# EAGLE design IT01 (EAGLE 6.3)
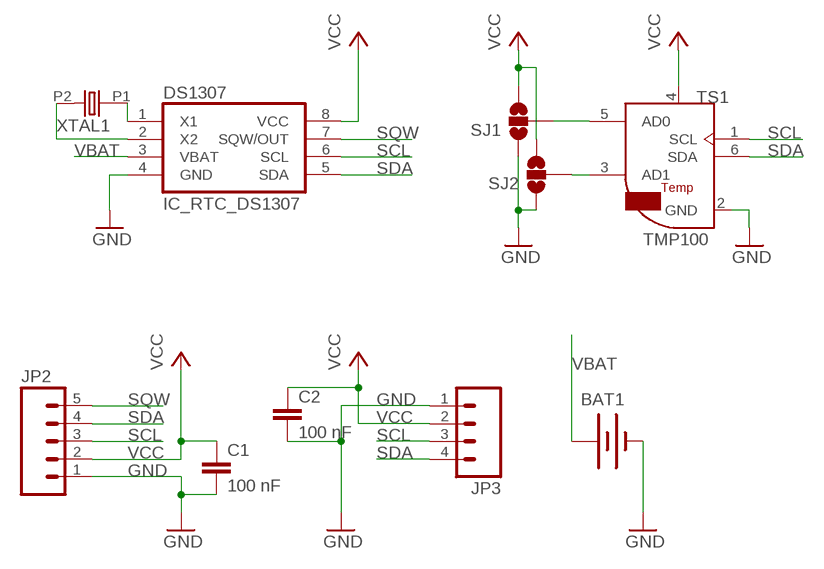
[diagram p0: schematic, sheet 1]

## Parts
BAT1  BATTERY12MM  [BATTCON_12MM]
C1  100 nF  C-EUC0805  [C0805]
C2  100 nF  C-EUC0805  [C0805]
DS1307  IC_RTC_DS1307  [SO-8]
JP2  M05PTH  [1X05]
JP3  M04PTH  [1X04]
SJ1  SOLDERJUMPER_2WAY-OLDT  [SJ_2]
SJ2  SOLDERJUMPER_2WAY-OLDT  [SJ_2]
TS1  TMP100  [SOT23-6]
XTAL1  OSC-XTAL-TC-38  [TC-38]

## Nets
AD0: SJ1.2 TS1.5(AD0)
AD1: SJ2.2 TS1.3(AD1)
GND: BAT1.GND(-) C1.2 C2.2 DS1307.4(GND) JP2.1 JP3.1 SJ1.1 SJ2.1 TS1.2(GND)
N$1: DS1307.1(X1) XTAL1.P1
N$2: DS1307.2(X2) XTAL1.P2
SCL: DS1307.6(SCL) JP2.3 JP3.3 TS1.1(SCL)
SDA: DS1307.5(SDA) JP2.4 JP3.4 TS1.6(SDA)
SQW: DS1307.7(SQW/OUT) JP2.5
VBAT: BAT1.PWR@1(+) DS1307.3(VBAT)
VCC: C1.1 C2.1 DS1307.8(VCC) JP2.2 JP3.2 SJ1.3 SJ2.3 TS1.4(UCC)

## Library data of the parts
BAT1 = SparkFun:BATTERY: Battery Holders Various common sizes : AA, AAA, 20mm coin cell and 12mm coin cell.
C1 C2 = resistor:C-EU: CAPACITOR, European symbol
DS1307 = dp_devices:IC_RTC_DS1307
JP2 = SparkFun:M05: Header 5 Standard 5-pin 0.1" header. Use with straight break away headers (SKU : PRT-00116), right angle break away headers (PRT-00553), swiss pins (PRT-00743), machine pins (PRT-00117), and female headers (PRT-00115). Molex polarized connector foot print use with SKU : PRT-08230 with associated crimp pins and housings.
JP3 = SparkFun:M04: Header 4 Standard 4-pin 0.1" header. Use with straight break away headers (SKU : PRT-00116), right angle break away headers (PRT-00553), swiss pins (PRT-00743), machine pins (PRT-00117), and female headers (PRT-00115). Molex polarized connector foot print use with SKU : PRT-08231 with associated crimp pins and housings. 1MM SMD Version SKU: PRT-10208
SJ1 SJ2 = SparkFun:SOLDERJUMPER_2WAY-OLD: Solder Jumper 2 way solder jumper
TS1 = termosensor:TMP100
XTAL1 = dp_devices:OSC-XTAL

## Board
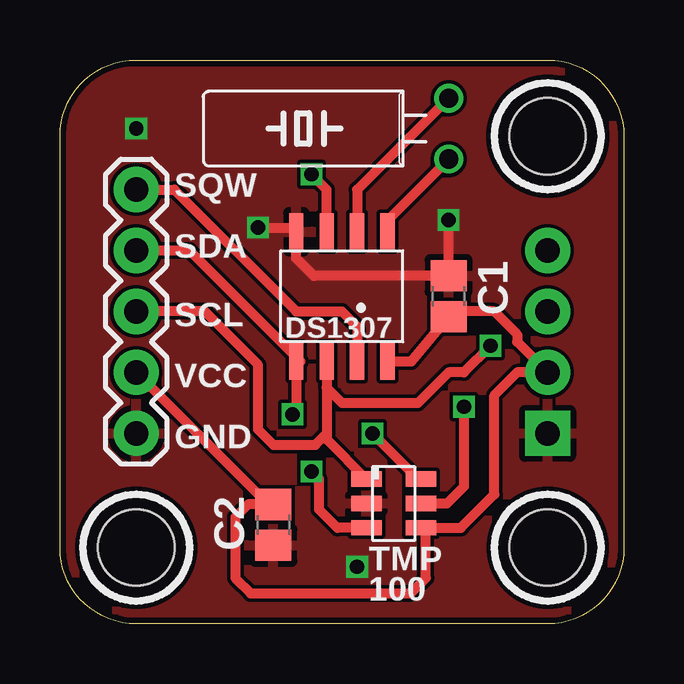
[diagram p1: board, top side]
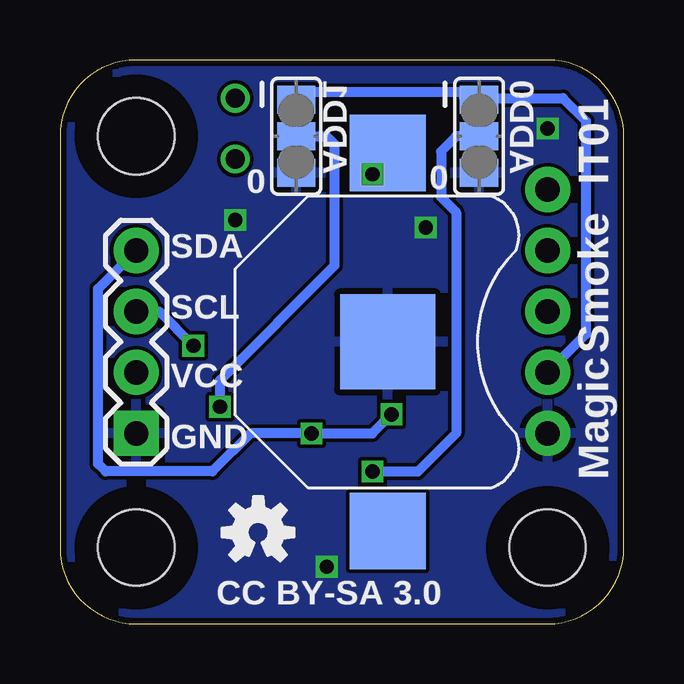
[diagram p2: board, bottom side, seen from below]

Size 23.5 x 23.5 mm. Coordinates in mm from the lower left corner, seen from the top.
Outline: 0,3.17 0,20.32 arc-90 3.17,23.5 20.32,23.5 arc-90 23.5,20.32 23.5,3.17 arc-90 20.32,0 3.17,0 arc-90 0,3.17
Copper layers (1*2*15*16): Top 0.035mm / dielectric 0.2mm / layer 2 0.0175mm / dielectric 1.1mm / layer 15 0.0175mm / dielectric 0.2mm / Bottom 0.035mm
Design rules "SeeedStudio_DRU_no_angle_20130527": minimum track width 6mil, minimum drill 12mil, track to track 6mil, track to pad 6mil, pad to pad 6mil, via to via 6mil, smd to smd 0mil, copper to edge 10mil, drill to drill 10mil, minimum pad ring 6mil, minimum via ring 6mil, stop-mask expansion 2mil, vias tented up to drill 25mil, thermal gap 10mil
Holes 3.17 mm at 3.17,3.17 20.32,3.17 20.32,20.32
tRestrict: area 17.8,17.8 to 22.9,22.9; area 0.6,0.6 to 5.7,5.7; area 17.8,0.6 to 22.9,5.7
bRestrict: area 17.8,17.8 to 22.9,22.9; area 0.6,0.6 to 5.7,5.7; area 17.8,0.6 to 22.9,5.7

### Footprints (pad centres in the part's own frame; a part is rotated, then mirrored left to right if it is on the bottom)
BATTCON_12MM = smd 3.962 x 3.962: GND 0,0 | smd 3.175 x 3.175: PWR@1 -7.874,0; PWR@2 7.874,0
C0805 = smd 1.3 x 1.5: 1 -0.85,0; 2 0.85,0
SO-8 = smd 0.6 x 1.55: 1 -1.905,-2.69; 2 -0.635,-2.69; 3 0.635,-2.69; 4 1.905,-2.69; 5 1.905,2.71; 6 0.635,2.71; 7 -0.635,2.71; 8 -1.905,2.71
1X05 = drill 1.016 pad 1.88: 1 0,0; 2 2.54,0; 3 5.08,0; 4 7.62,0; 5 10.16,0
1X04 = drill 1.016 pad 1.88 square: 1 0,0 | drill 1.016 pad 1.88: 2 2.54,0; 3 5.08,0; 4 7.62,0
SJ_2 = smd 1.168 x 1.6: 1 -1.524,0; 2 0,0; 3 1.524,0
SOT23-6 = smd 0.635 x 1.27: 1 1.27,-0.254; 2 2.286,-0.254; 3 3.302,-0.254; 4 3.302,2.032; 5 2.286,2.032; 6 1.27,2.032
TC-38 = drill 0.8: P1 -1.27,-2.54; P2 1.27,-2.54

### Placement (x,y rotation side)
BAT1  9.84,11.75 270 bottom
C1  16.19,13.65 90 top
C2  8.89,4.13 270 top
DS1307  11.75,13.65 180 top
JP2  3.17,7.94 90 top
JP3  20.32,7.94 90 bottom
SJ1  13.65,20.32 90 bottom
SJ2  6.03,20.32 90 bottom
TS1  13.02,7.3 270 top
U$1  [OSHW-LOGO-S]  15.24,3.81 0 bottom
XTAL1  13.65,20.64 90 top

### Tracks (layer width: path | path; a pad name or v marks a point on that pad's centre or on a via)
AD0  (via drill 0.6)
  Top 0.406: v16.83,9.05 16.83,5.71 16.13,5.02 TS1.5
  Bottom 0.406: SJ1.2 12.38,20.32 12.06,20 12.06,14.92 16.83,10.16 v16.83,9.05
AD1  (via drill 0.6)
  Top 0.406: v10.48,6.35 10.79,6.03 10.79,4.76 11.56,4 TS1.3
  Bottom 0.406: SJ2.2 6.99,20.32 7.62,19.68 7.62,17.78 6.99,17.14 6.99,7.94 8.57,6.35 v10.48,6.35
GND  (via drill 0.6)
  Top 0.406: v8.26,16.51 9.69,16.51 DS1307.4 9.84,15.24 10.58,14.5 C1.2 v16.19,16.83
  other vias: 3.17,20.64 12.38,2.38
  pour Bottom: -0.64,-0.64 -0.64,24.13 24.13,24.13 24.13,-0.64
  pour Top: -1.27,-1.27 -1.27,24.77 24.77,24.77 24.77,-1.27
N$1
  Top 0.406: DS1307.1 13.65,16.83 XTAL1.P1
N$2
  Top 0.406: XTAL1.P2 12.38,18.1 DS1307.2
SCL  (via drill 0.6)
  Top 0.406: 11.11,9.84 11.11,7.94 | 11.11,7.94 11.11,7.68 TS1.1 | JP2.3 6.03,13.02 8.26,10.79 8.26,8.1 8.89,7.46 10.64,7.46 11.11,7.94 | DS1307.6 11.11,9.84 | 11.11,9.84 11.75,9.21 14.92,9.21 16.19,10.48 16.83,10.48 v17.94,11.59
  Bottom 0.406: JP3.3 19.37,13.02 v17.94,11.59
SDA  (via drill 0.6)
  Top 0.406: v9.68,8.73 9.84,9.05 DS1307.5 10.01,10.94 5.4,15.56 JP2.4 | TS1.6 14.92,6.03 v13.02,7.94
  Bottom 0.406: v9.68,8.73 10.48,7.94 v13.02,7.94 15.56,7.94 17.14,6.35 21.59,6.35 21.91,6.67 21.91,13.97 JP3.4
SQW
  Top 0.406: JP2.5 4.76,18.1 9.84,13.02 11.75,13.02 12.38,12.38 12.38,11.11 DS1307.7
VBAT  (via drill 0.6)
  Top 0.406: DS1307.3 11.11,18.1 v10.48,18.73
  Bottom 0.406: 10.79,20.64 v10.48,18.73 8.95,18.73 BAT1.PWR@1
VCC
  Top 0.406: JP2.2 8.68,4.98 C2.1 7.83,4.98 7.3,4.45 7.3,1.91 7.94,1.27 14.61,1.27 15.24,1.91 15.24,3.81 TS1.4 16.7,4 18.1,5.4 18.1,9.53 19.05,10.48 JP3.2 19.05,11.75 19.05,12.06 18.1,13.02 16.41,13.02 C1.1 | DS1307.8 14.65,10.94 C1.1 | C1.1 15.98,12.48 16.19,12.7
  Bottom 0.406: JP2.2 1.59,12.06 1.59,20.95 2.54,21.91 5.71,21.91 | 6.67,21.91 5.71,21.91 | 5.71,22.16 13.34,22.16 SJ1.3 | 5.71,21.91 5.78,21.84 SJ2.3 5.71,22.16 | 5.65,22.16 5.71,22.16

### Text on the board
tPlace: SQW | SDA | SCL | VCC | GND | TMP | 100
bPlace: IT01 | ADD0 | ADD1 | 0 | 0 | Smoke | SDA | SCL | Magic | VCC | GND | CC BY-SA 3.0